# EAGLE design USBprotector (EAGLE 7.7.0)
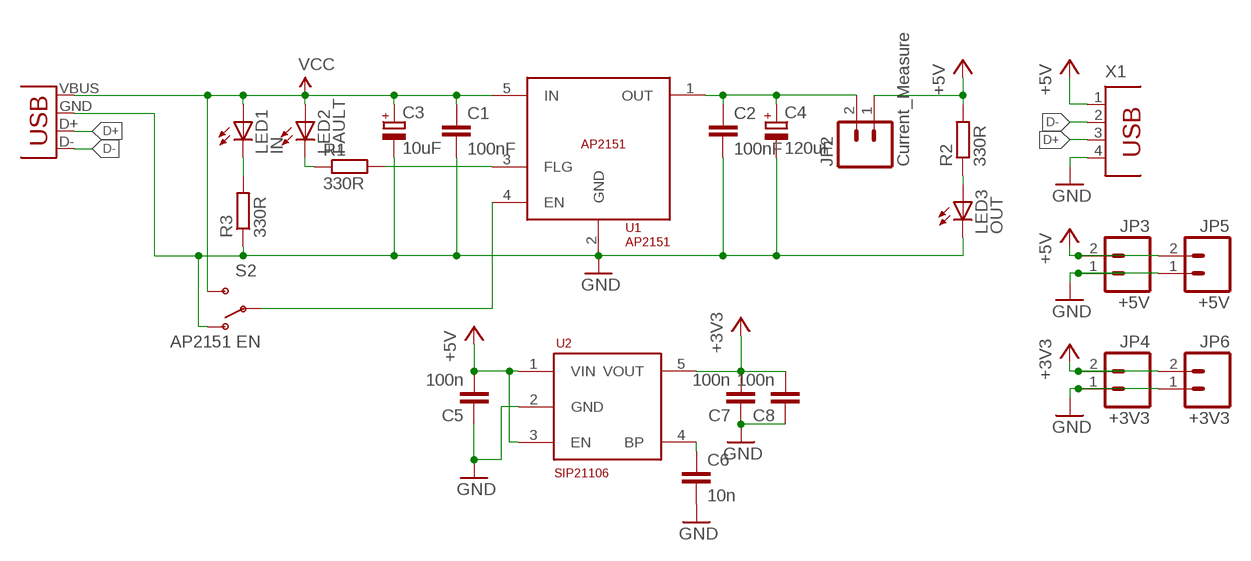
[diagram p0: schematic, sheet 1]

## Parts
C1  100nF  C-EUC0805  [C0805]
C2  100nF  C-EUC0805  [C0805]
C3  10uF  CPOL-EUSMCC  [SMC_C]
C4  120uF  CPOL-EUSMCC  [SMC_C]
C5  100n  C-EUC0805  [C0805]
C6  10n  C-EUC0805  [C0805]
C7  100n  C-EUC0603  [C0603]
C8  100n  C-EUC0805  [C0805]
JP1  USB-A-H  [USB-A-H]
JP2  Current_Measure  M02PTH  [1X02]
JP3  +5V  M023.5MM  [SCREWTERMINAL-3.5MM-2]
JP4  +3V3  M023.5MM  [SCREWTERMINAL-3.5MM-2]
JP5  +5V  M02POLAR_LOCK  [MOLEX-1X2_LOCK]
JP6  +3V3  M02POLAR_LOCK  [MOLEX-1X2_LOCK]
LED1  IN  LED3MM  [LED3MM]
LED2  FAULT  LED3MM  [LED3MM]
LED3  OUT  LED3MM  [LED3MM]
R1  330R  R-EU_R1206  [R1206]
R2  330R  R-EU_R1206  [R1206]
R3  330R  R-EU_R1206  [R1206]
S2  AP2151 EN  SWITCH-SPDTPTH  [SWITCH-SPDT]
U1  AP2151  [SOT23-5]
U2  SIP21106  [SOT23-5]
X1  PN87520  [PN87520]

## Nets
5V_OUT: C2.1 C4.+ JP2.2 U1.1(OUT)
+3V3: C7.2 C8.2 JP4.2 JP6.2 U2.5(VOUT)
+5V: C5.2 JP2.1 JP3.2 JP5.2 R2.2 U2.1(VIN) U2.3(EN) X1.1
D+: JP1.D+(D-) X1.3
D-: JP1.D-(D+) X1.2
EN: S2.2(P) U1.4(EN)
FAULT: R1.2 U1.3(FLG)
GND: C1.2 C2.2 C3.- C4.- C5.1 C6.2 C7.1 C8.1 JP1.GND(VBUS) JP3.1 JP4.1 JP5.1 JP6.1 LED3.K(C) R3.1 S2.1(O) U1.2(GND) U2.2(GND) X1.4
N$1: LED3.A R2.1
N$2: LED2.K(C) R1.1
N$3: C6.1 U2.4(BP)
N$10: LED1.K(C) R3.2
VCC: C1.1 C3.+ JP1.VBUS(GND) LED1.A LED2.A S2.3(S) U1.5(IN)

## Library data of the parts
C1 C2 C5-C8 = rcl:C-EU: CAPACITOR, European symbol
C3 C4 = rcl:CPOL-EU: POLARIZED CAPACITOR, European symbol
JP1 = SparkFun-Connectors:USB: USB Connectors USB-B-PTH is fully proven SKU : PRT-00139/CONN-08278 USB-miniB is fully proven SKU : PRT-00587 USB-A-PCB is untested. USB-A-H is throughly reviewed, but untested. Spark Fun Electronics SKU : PRT-00437 USB-B-SMT is throughly reviewed, but untested. Needs silkscreen touching up. USB-A-S has not been used/tested USB-MB-H has not been used/tested USB-MICROB has been used. CONN-09505
JP2-JP6 = SparkFun-Connectors:M02: Header 2 Standard 2-pin 0.1" header. Use with straight break away headers (SKU : PRT-00116), right angle break away headers (PRT-00553), swiss pins (PRT-00743), machine pins (PRT-00117), and female headers (PRT-00115). Molex polarized connector foot print use with SKU : PRT-08233 with associated crimp pins and housings.
LED1-LED3 = led:LED: LED OSRAM: - CHIPLED LG R971, LG N971, LY N971, LG Q971, LY Q971, LO R971, LY R971 LH N974, LH R974 LS Q976, LO Q976, LY Q976 LO Q996 - Hyper CHIPLED LW Q18S LB Q993, LB Q99A, LB R99A - SideLED LS A670, LO A670, LY A670, LG A670, LP A670 LB A673, LV A673, LT A673, LW A673 LH A674 LY A675 LS A676, LA A676, LO A676, LY A676, LW A676 LS A679, LY A679, LG A679 - Hyper Micro SIDELED® LS Y876, LA Y876, LO Y876, LY Y876 LT Y87S - SmartLED LW L88C, LW L88S LB L89C, LB L89S, LG L890 LS L89K, LO L89K, LY L89K LS L896, LA L896, LO L896, LY L896 - TOPLED LS T670, LO T670, LY T670, LG T670, LP T670 LSG T670, LSP T670, LSY T670, LOP T670, LYG T670 LG T671, LOG T671, LSG T671 LB T673, LV T673, LT T673, LW T673 LH T674 LS T676, LA T676, LO T676, LY T676, LB T676, LH T676, LSB T676, LW T676 LB T67C, LV T67C, LT T67C, LS T67K, LO T67K, LY T67K, LW E67C LS E67B, LA E67B, LO E67B, LY E67B, LB E67C, LV E67C, LT E67C LW T67C LS T679, LY T679, LG T679 LS T770, LO T770, LY T770, LG T770, LP T770 LB T773, LV T773, LT T773, LW T773 LH T774 LS E675, LA E675, LY E675, LS T675 LS T776, LA T776, LO T776, LY T776, LB T776 LHGB T686 LT T68C, LB T68C - Hyper Mini TOPLED® LB M676 - Mini TOPLED Santana® LG M470 LS M47K, LO M47K, LY M47K Source: http://www.osram.convergy.de LUXEON: - LUMILED® LXK2-PW12-R00, LXK2-PW12-S00, LXK2-PW14-U00, LXK2-PW14-V00 LXK2-PM12-R00, LXK2-PM12-S00, LXK2-PM14-U00 LXK2-PE12-Q00, LXK2-PE12-R00, LXK2-PE12-S00, LXK2-PE14-T00, LXK2-PE14-U00 LXK2-PB12-K00, LXK2-PB12-L00, LXK2-PB12-M00, LXK2-PB14-N00, LXK2-PB14-P00, LXK2-PB14-Q00 LXK2-PR12-L00, LXK2-PR12-M00, LXK2-PR14-Q00, LXK2-PR14-R00 LXK2-PD12-Q00, LXK2-PD12-R00, LXK2-PD12-S00 LXK2-PH12-R00, LXK2-PH12-S00 LXK2-PL12-P00, LXK2-PL12-Q00, LXK2-PL12-R00 Source: www.luxeon.com KINGBRIGHT: KA-3528ASYC Source: www.kingbright.com
R1-R3 = rcl:R-EU_: RESISTOR, European symbol
S2 = SparkFun-Electromechanical:SWITCH-SPDT: SPDT Switch Simple slide switch, Spark Fun Electronics SKU : COM-00102 DPDT SMT slide switch, AYZ0202, SWCH-08179
U1 = custom_parts:AP2151
U2 = cs5463:SIP21106
X1 = con-berg:PN87520: BERG USB connector; OC_FARNELL: unknown; OC_NEWARK: unknown

## Board
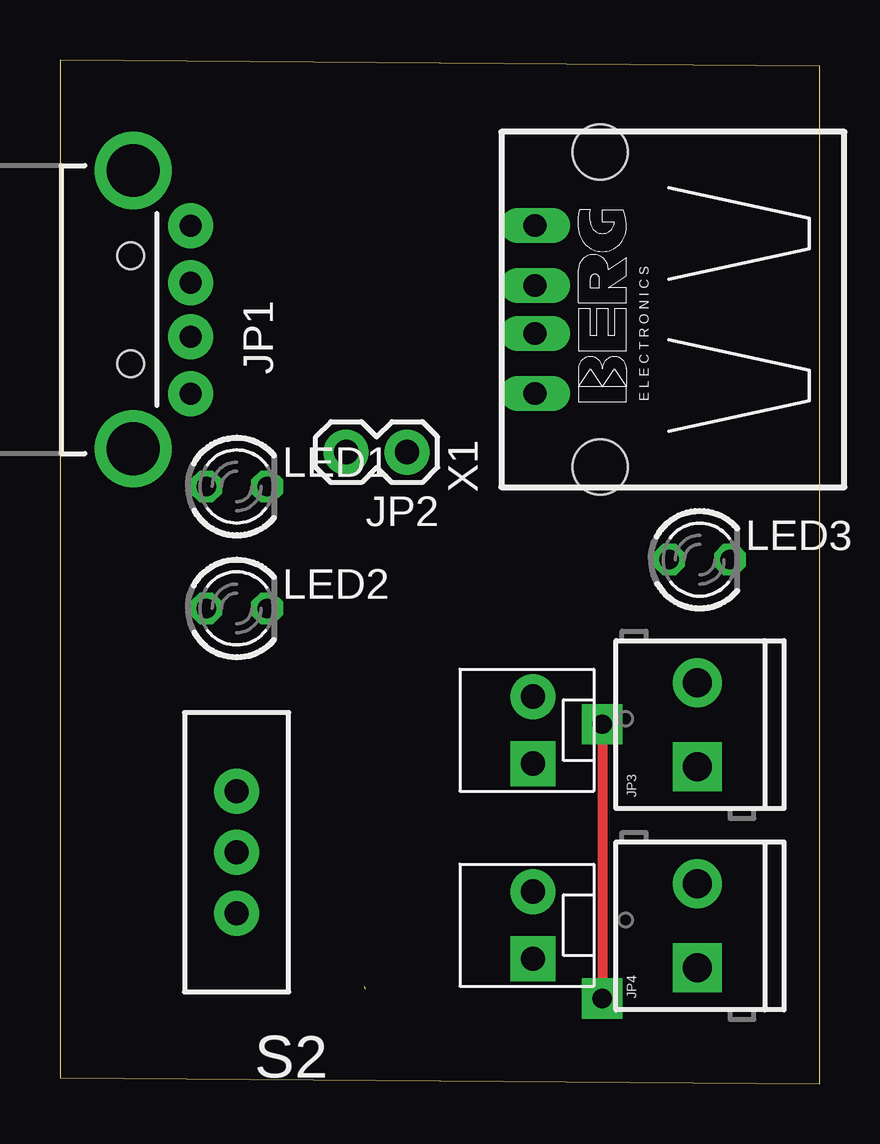
[diagram p1: board, top side]
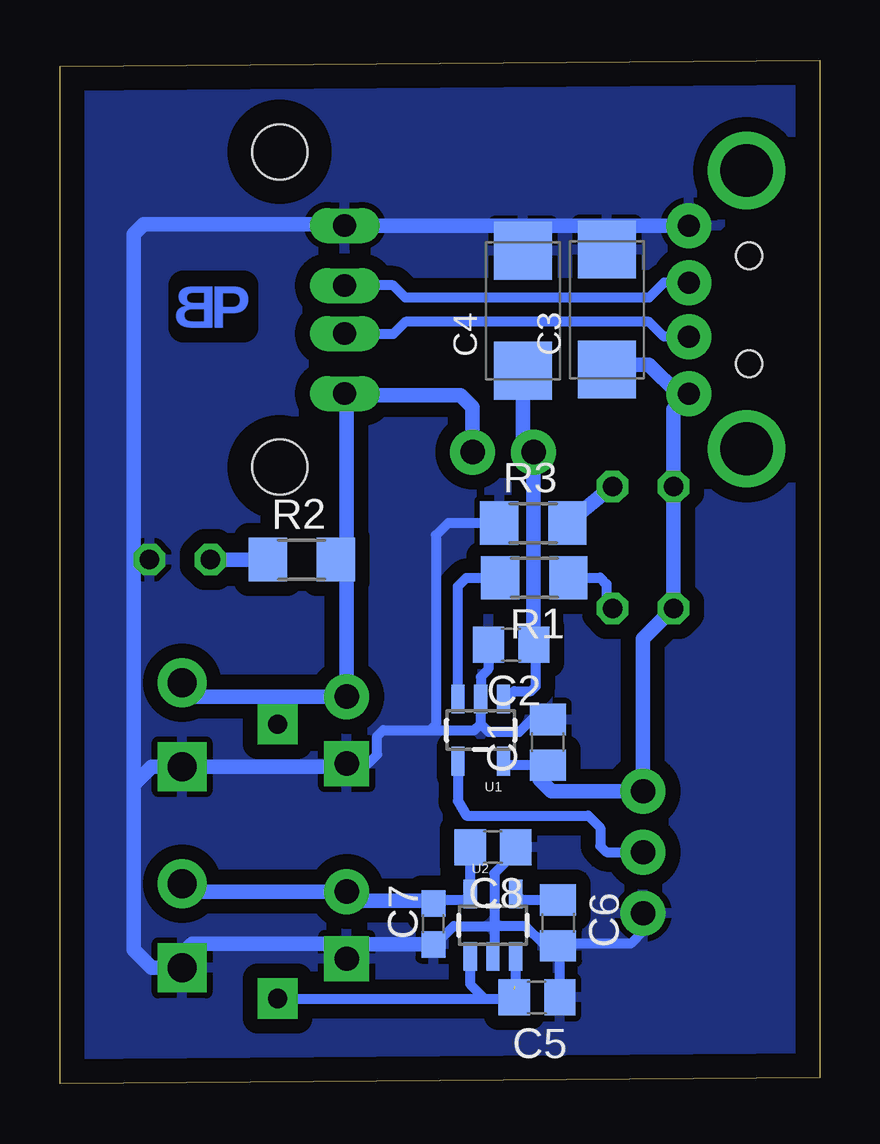
[diagram p2: board, bottom side, seen from below]

Size 31.67 x 42.66 mm. Coordinates in mm from the lower left corner, seen from the top.
Outline: 0,0.25 31.67,0 31.67,42.41 0,42.66 0,0.25
Copper layers (1*16): Top 0.035mm / dielectric 1.5mm / Bottom 0.035mm
Design rules "default": minimum track width 10mil, minimum drill 24mil, track to track 8mil, track to pad 8mil, pad to pad 8mil, via to via 8mil, smd to smd 8mil, copper to edge 40mil, drill to drill 8mil, minimum pad ring 10mil, minimum via ring 8mil, stop-mask expansion 4mil, vias tented up to drill 0mil, thermal gap 10mil

### Footprints (pad centres in the part's own frame; a part is rotated, then mirrored left to right if it is on the bottom)
C0805 = smd 1.3 x 1.5: 1 -0.95,0; 2 0.95,0
SMC_C = smd 2.4 x 2.4: + -2.5,0; - 2.5,0
C0603 = smd 1.1 x 1: 1 -0.85,0; 2 0.85,0
USB-A-H = drill 0.914 pad 1.88: D+ 2.4,1.127; D- 2.4,-1.127; GND 2.4,3.5; VBUS 2.4,-3.5 | drill 2.2: GND2 0,-5.8; GND3 0,5.8 | hole 1.1: -0.1,2.25; -0.1,-2.25
1X02 = drill 1.016 pad 1.88: 1 0,0; 2 2.54,0
SCREWTERMINAL-3.5MM-2 = drill 1.2 pad 2.032 square: 1 0,0 | drill 1.2 pad 2.032: 2 3.5,0
MOLEX-1X2_LOCK = drill 1.016 pad 1.88 square: 1 -0.127,0 | drill 1.016 pad 1.88: 2 2.667,0
LED3MM = drill 0.813 octagon: A -1.27,0; K 1.27,0
R1206 = smd 1.6 x 1.803: 1 -1.422,0; 2 1.422,0
SWITCH-SPDT = drill 1.016 pad 1.88: 1 0,2.54; 2 0,0; 3 0,-2.54
SOT23-5 = smd 0.55 x 1.2: 1 -0.95,-1.3; 2 0,-1.3; 3 0.95,-1.3; 4 0.95,1.3; 5 -0.95,1.3
PN87520 = drill 0.95 long: 1 -3.5,2.71; 2 -1,2.71; 3 1,2.71; 4 3.5,2.71 | hole 2.3: -6.57,0; 6.57,0

### Placement (x,y rotation side)
C1  11.34,14.23 90 bottom
C2  12.86,18.3 180 bottom
C3  8.87,32.26 90 bottom
C4  12.37,32.21 90 bottom
C5  11.79,3.6 180 bottom
C6  10.9,6.71 270 bottom
C7  16.11,6.67 90 bottom
C8  13.62,9.87 180 bottom
JP1  3.05,32.26 0 top
JP2  14.47,26.32 180 top
JP3  26.58,13.22 90 top
JP4  26.58,4.83 90 top
JP5  19.72,13.47 90 top
JP6  19.72,5.34 90 top
LED1  7.37,24.89 0 top
LED2  7.37,19.81 0 top
LED3  26.67,21.84 0 top
R1  11.9,21.09 180 bottom
R2  21.59,21.84 0 bottom
R3  11.94,23.37 0 bottom
S2  7.37,9.65 180 top
U1  14.13,14.74 180 bottom
U2  13.62,6.61 0 bottom
X1  22.51,32.27 90 top

### Tracks (layer width: path | path; a pad name or v marks a point on that pad's centre or on a via)
5V_OUT
  Bottom 0.406: U1.1 13.05,16.04 12.73,16.36 12.03,16.36 11.83,16.56 11.83,17.71 C2.1 | C2.1 11.94,18.3 | 11.93,18.31 C2.1
  Bottom 0.61: 11.94,17.81 C2.1 | C4.+ 12.37,26.76 JP2.2 11.93,18.31
+3V3
  Bottom 0.406: C8.2 U2.5 14.81,7.67 16.06,7.67 16.11,7.63 C7.2
  Bottom 0.61: JP4.2 26.25,8.01 JP6.2 19.34,7.63 16.11,7.63
+5V  (via drill 0.8 pad 1.68)  (1 unrouted)
  Top 0.406: v22.61,14.99 v22.61,3.56
  Bottom 0.406: 22.74,16.14 v22.61,14.99 | C5.2 12.74,3.95 12.86,4.07 12.67,4.26 U2.3 | v22.61,3.56 13.97,3.56 | 13.97,3.56 13.21,3.56 12.7,4.06 | U2.1 14.57,4.16 13.97,3.56
  Bottom 0.61: JP3.2 26,16.14 22.74,16.14 JP5.2 19.72,21.59 | JP2.1 14.47,28.19 14.99,28.7 19.74,28.7 X1.1 19.72,28.68 19.72,21.59 | R2.2 19.97,21.84 19.72,21.59
D+
  Bottom 0.406: JP1.D+ 6.49,33.38 7.11,32.77 17.27,32.77 17.78,33.27 X1.3
D-
  Bottom 0.406: JP1.D- 6.49,31.13 7.11,31.75 17.27,31.75 17.78,31.24 19.78,31.24 X1.2
EN
  Bottom 0.406: U1.4 15.08,11.78 14.73,11.18 9.65,11.18 9.14,10.67 9.14,9.91 8.89,9.65 S2.2
FAULT
  Bottom 0.406: U1.3 15.08,20.73 14.73,21.08 13.33,21.08 R1.2
GND
  Bottom 0.406: C8.1 12.67,9.66 13.56,8.77 13.56,6.57 | 13.56,6.57 13.56,5.37 U2.2 | C6.2 11.45,5.76 11.48,5.79 | 11.48,5.79 12.26,6.57 13.56,6.57 | C7.1 16.02,5.82 15.26,6.57 13.56,6.57 | C1.2 12.01,15.18 12.53,14.66 13.8,14.66 14.13,14.99 | 14.13,14.99 U1.2 14.13,16.96 13.81,17.28 C2.2 | JP5.1 18.83,13.34 18.45,13.72 18.45,14.49 18.2,14.74 16.26,14.74 | 14.13,14.99 14.39,14.74 16.26,14.74 | C6.2 | C5.1 10.84,5.69 C6.2 | S2.1 7.37,6.35 7.87,5.84 11.43,5.84 11.48,5.79 | R3.1 15.49,23.37 16,22.86 16,14.99 16.26,14.74
  Bottom 0.61: JP5.1 19.85,13.22 JP3.1 27.85,13.22 28.61,12.45 | 28.61,12.45 28.61,5.6 27.85,4.83 JP4.1 26.67,4.93 26.67,5.33 26.16,5.84 20.57,5.84 19.95,5.21 JP6.1 19.12,5.82 C7.1 | JP1.GND 9.4,35.76 | 9.4,35.76 19.76,35.76 20.07,36.07 | C3.- 8.87,35.23 9.4,35.76 | 28.61,12.45 28.61,35.4 28.19,35.81 19.85,35.81 X1.4
  pour Bottom (isolate 0.61): 0,42.42 31.75,42.42 31.75,0.25 0.76,1.02
N$1
  Bottom 0.61: R2.1 LED3.A
N$2
  Bottom 0.406: R1.1 9.15,21.09 8.89,20.83 8.89,20.07 LED2.K
N$3
  Bottom 0.406: C6.1 12.42,7.66 U2.4
N$8  (via drill 1.5)
  other vias: 22.5,38.85
N$9  (via drill 1.5)
  other vias: 22.5,25.65
N$10
  Bottom 0.61: LED1.K R3.2
VCC
  Bottom 0.406: C1.1 13.02,13.28 U1.5
  Bottom 0.61: 8.38,29.27 C3.+ 8.66,29.97 7.11,29.97 5.9,28.76 JP1.VBUS 6.1,28.11 LED1.A LED2.A 7.37,18.54 S2.3 11.18,12.19 11.68,12.7 11.68,13.19 C1.1

### Text on the board
Bottom: B | P